# Altium schematic sheet Sheet1.SchDoc
size 839 x 594 mm; SheetNumber: 1; SheetTotal: 3
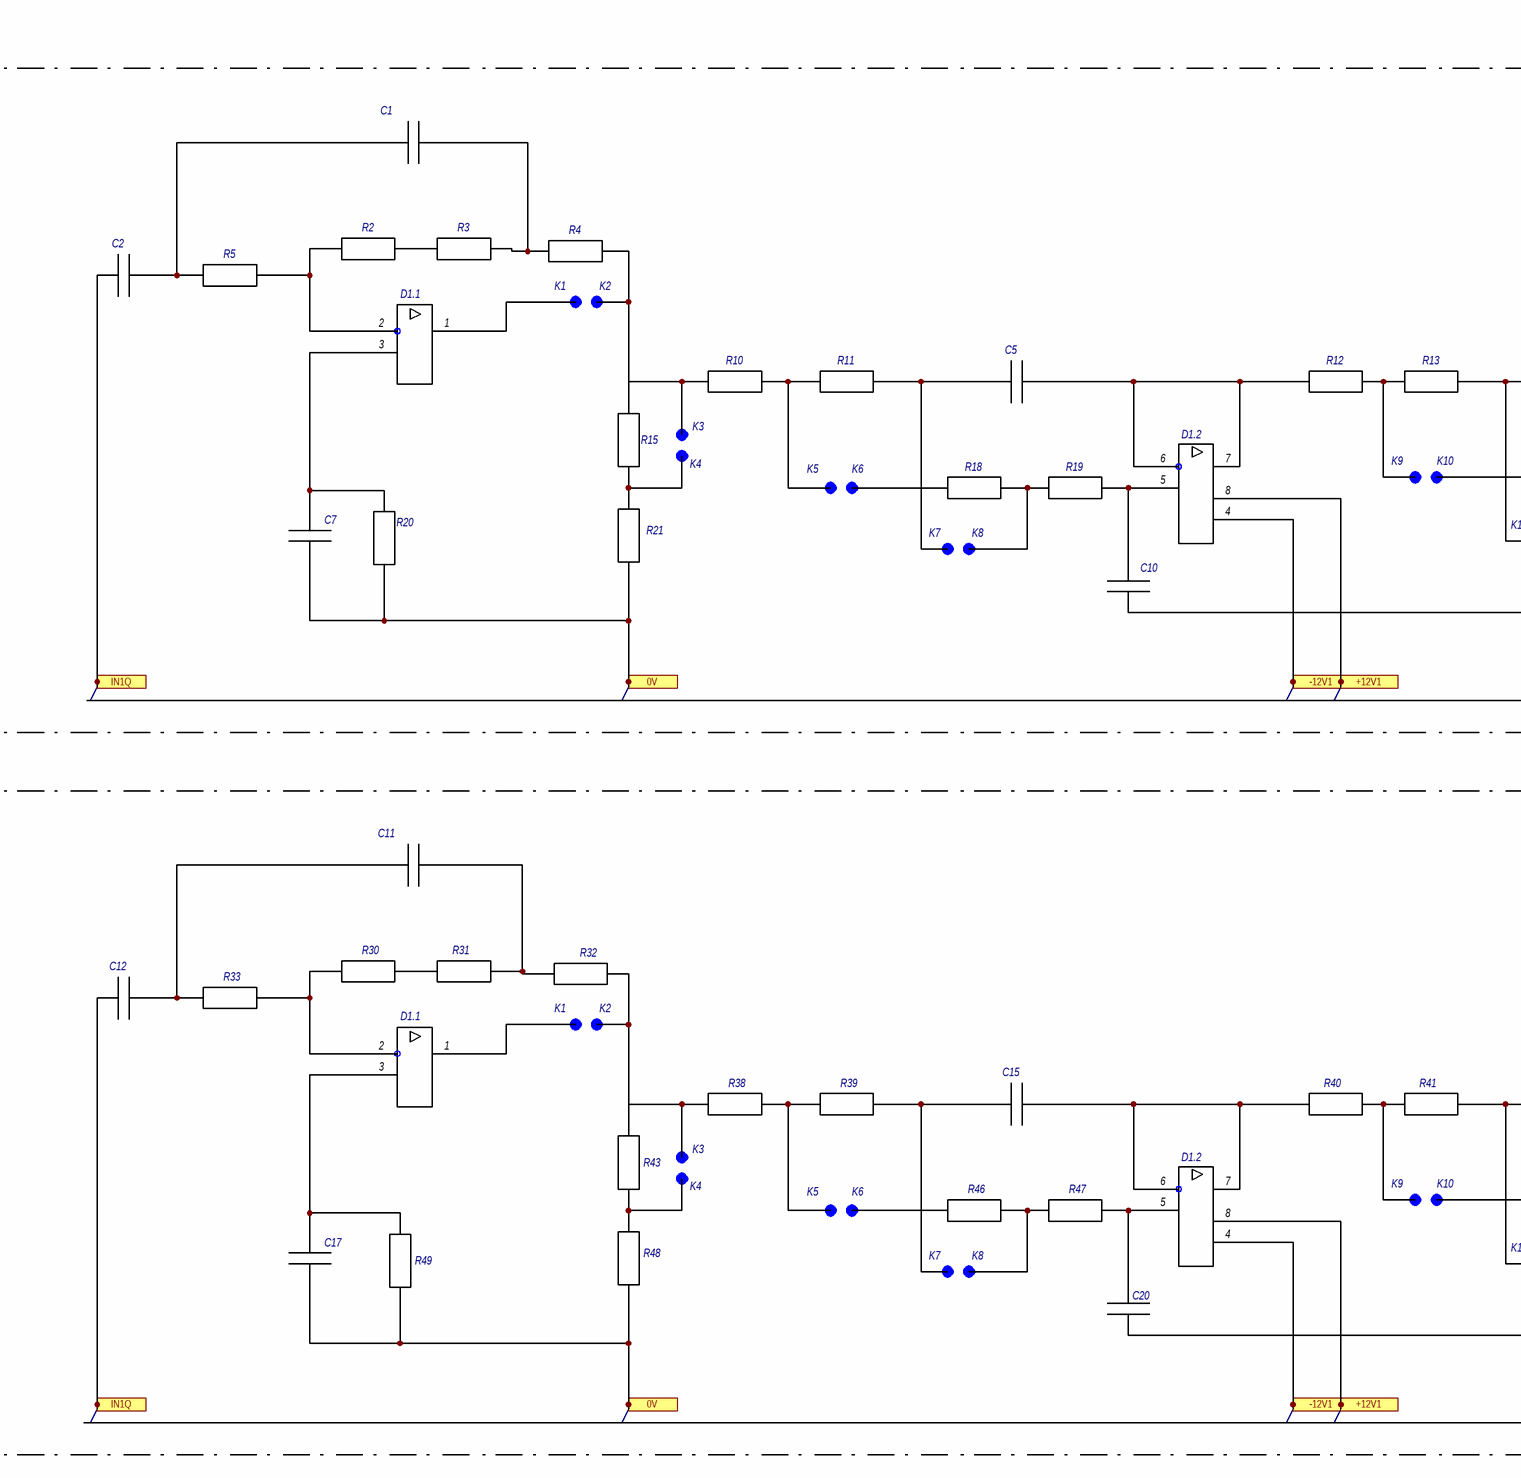
[diagram p0: Sheet1.SchDoc, top left]
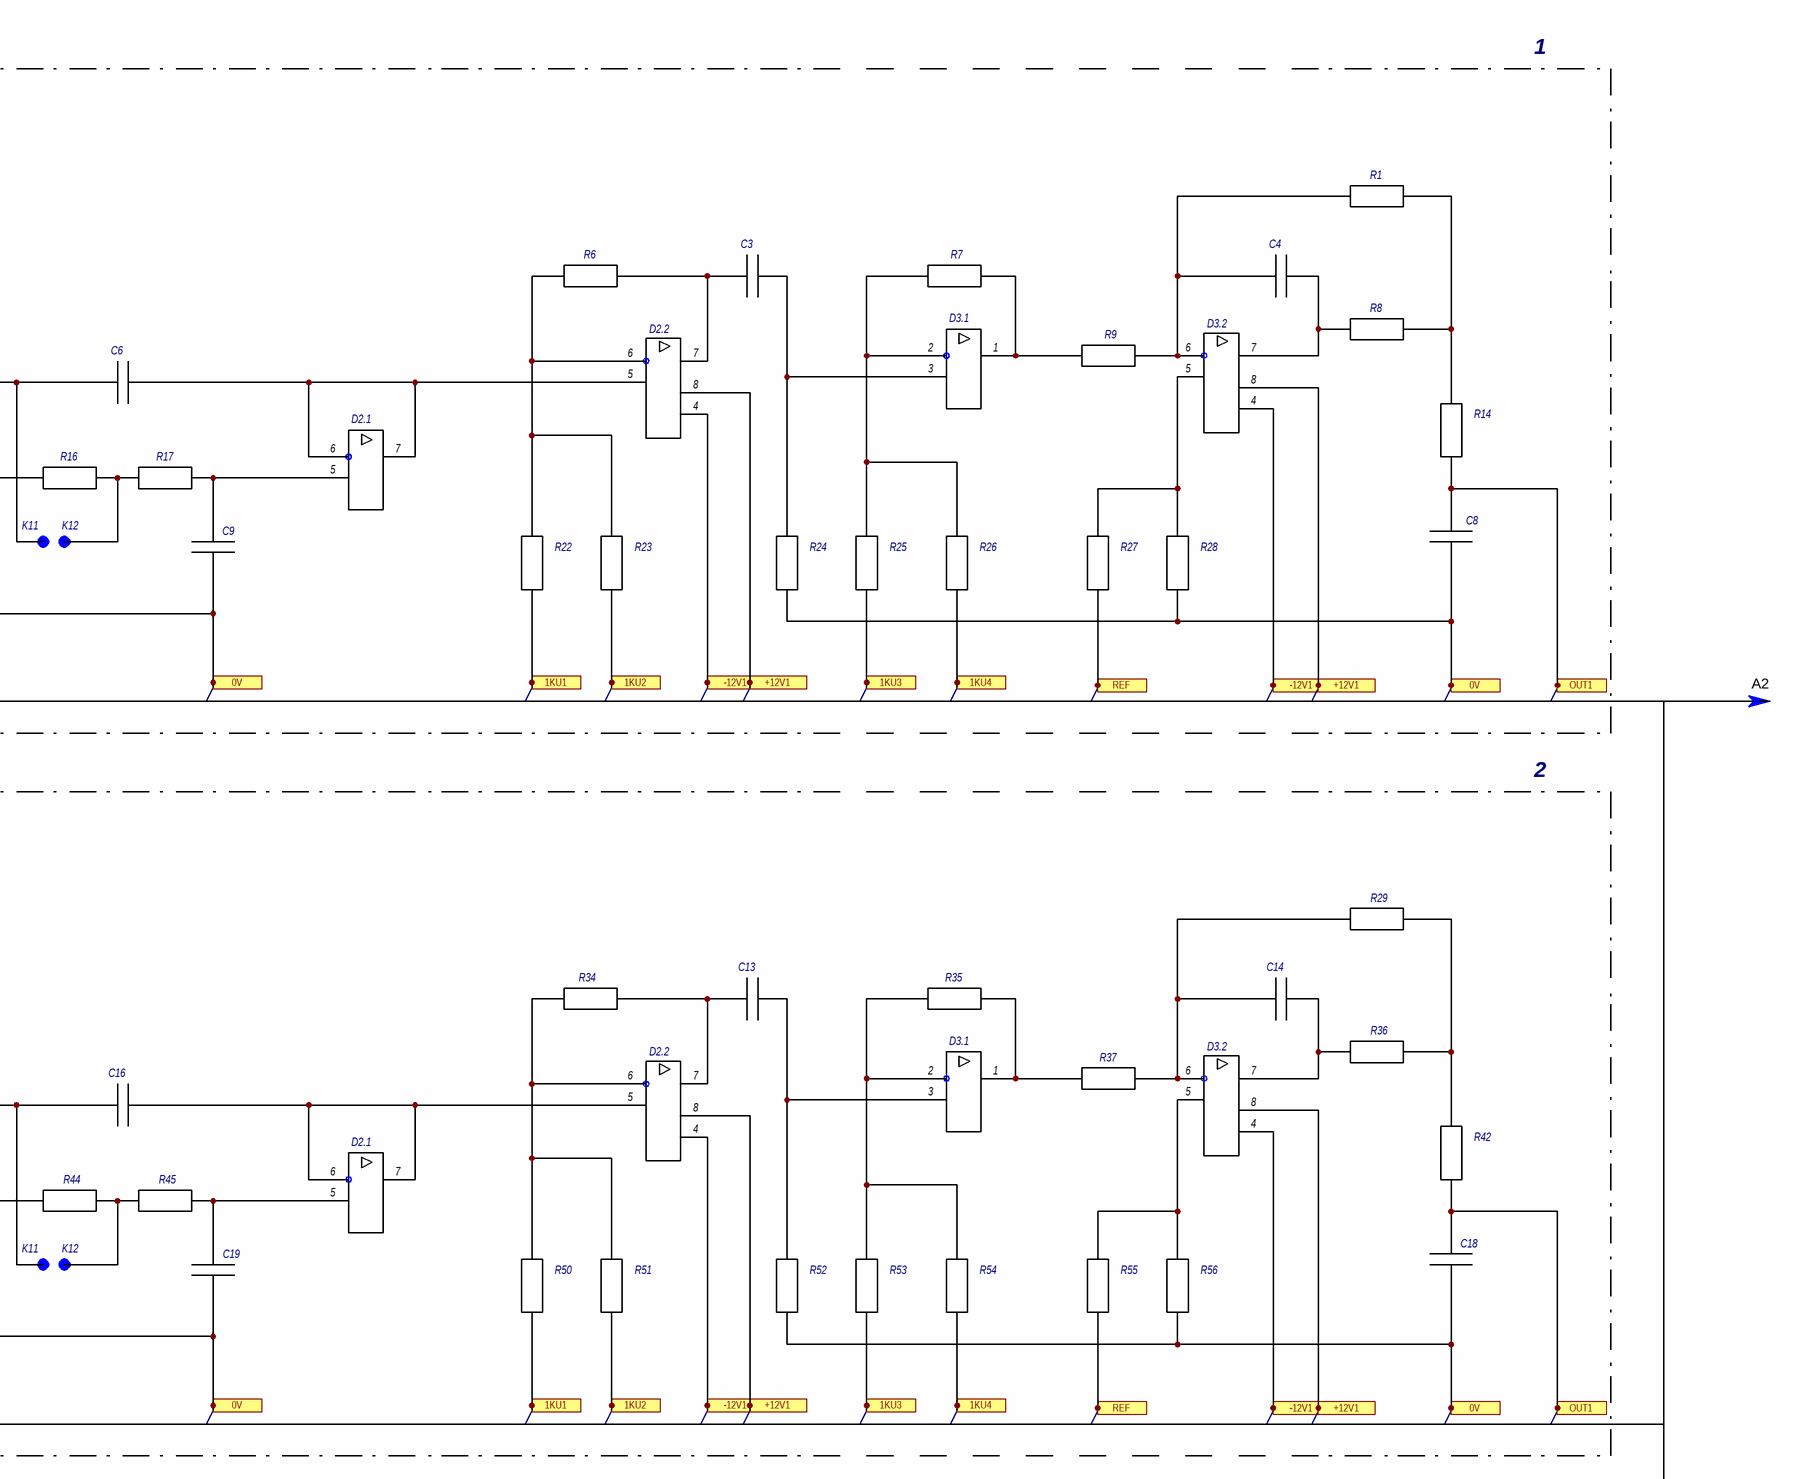
[diagram p1: Sheet1.SchDoc, top right]
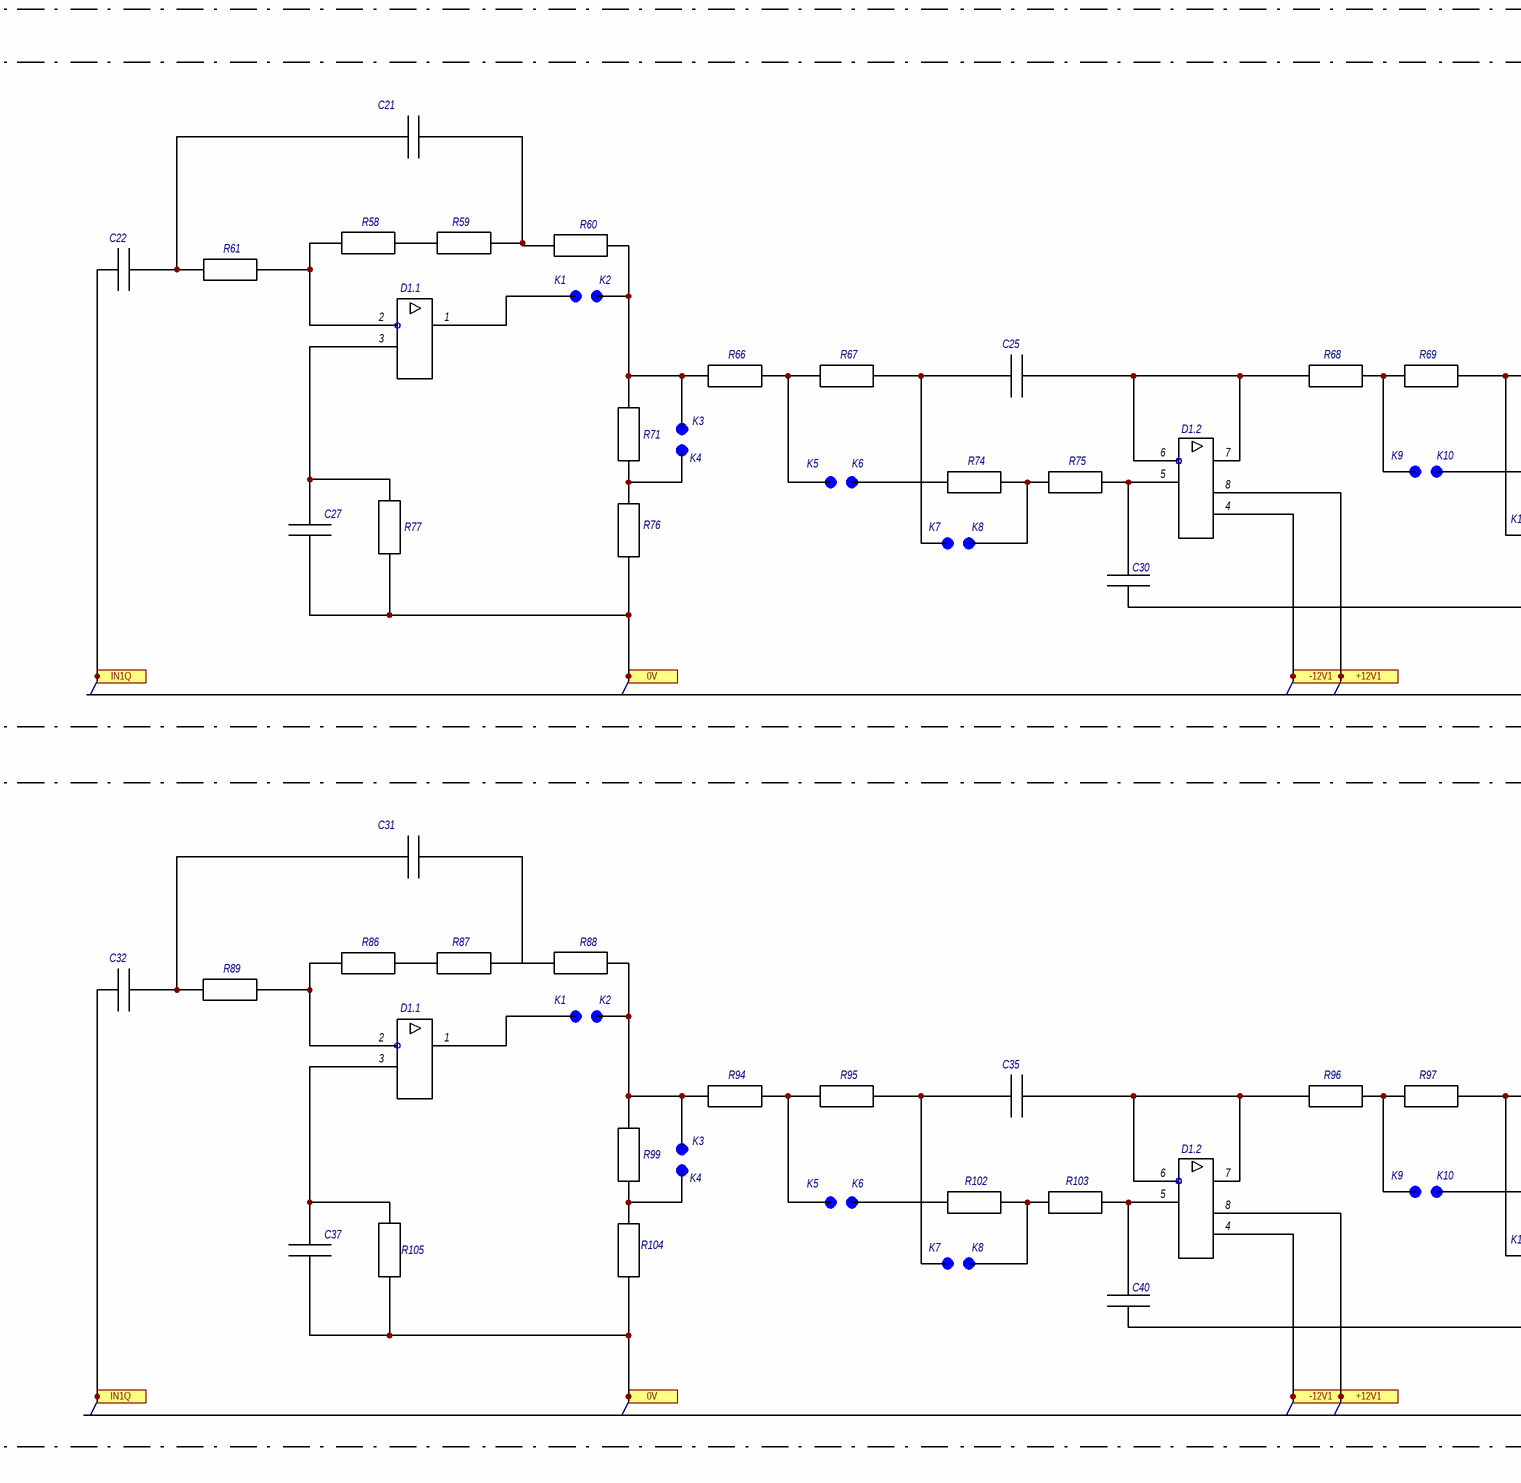
[diagram p2: Sheet1.SchDoc, bottom left]
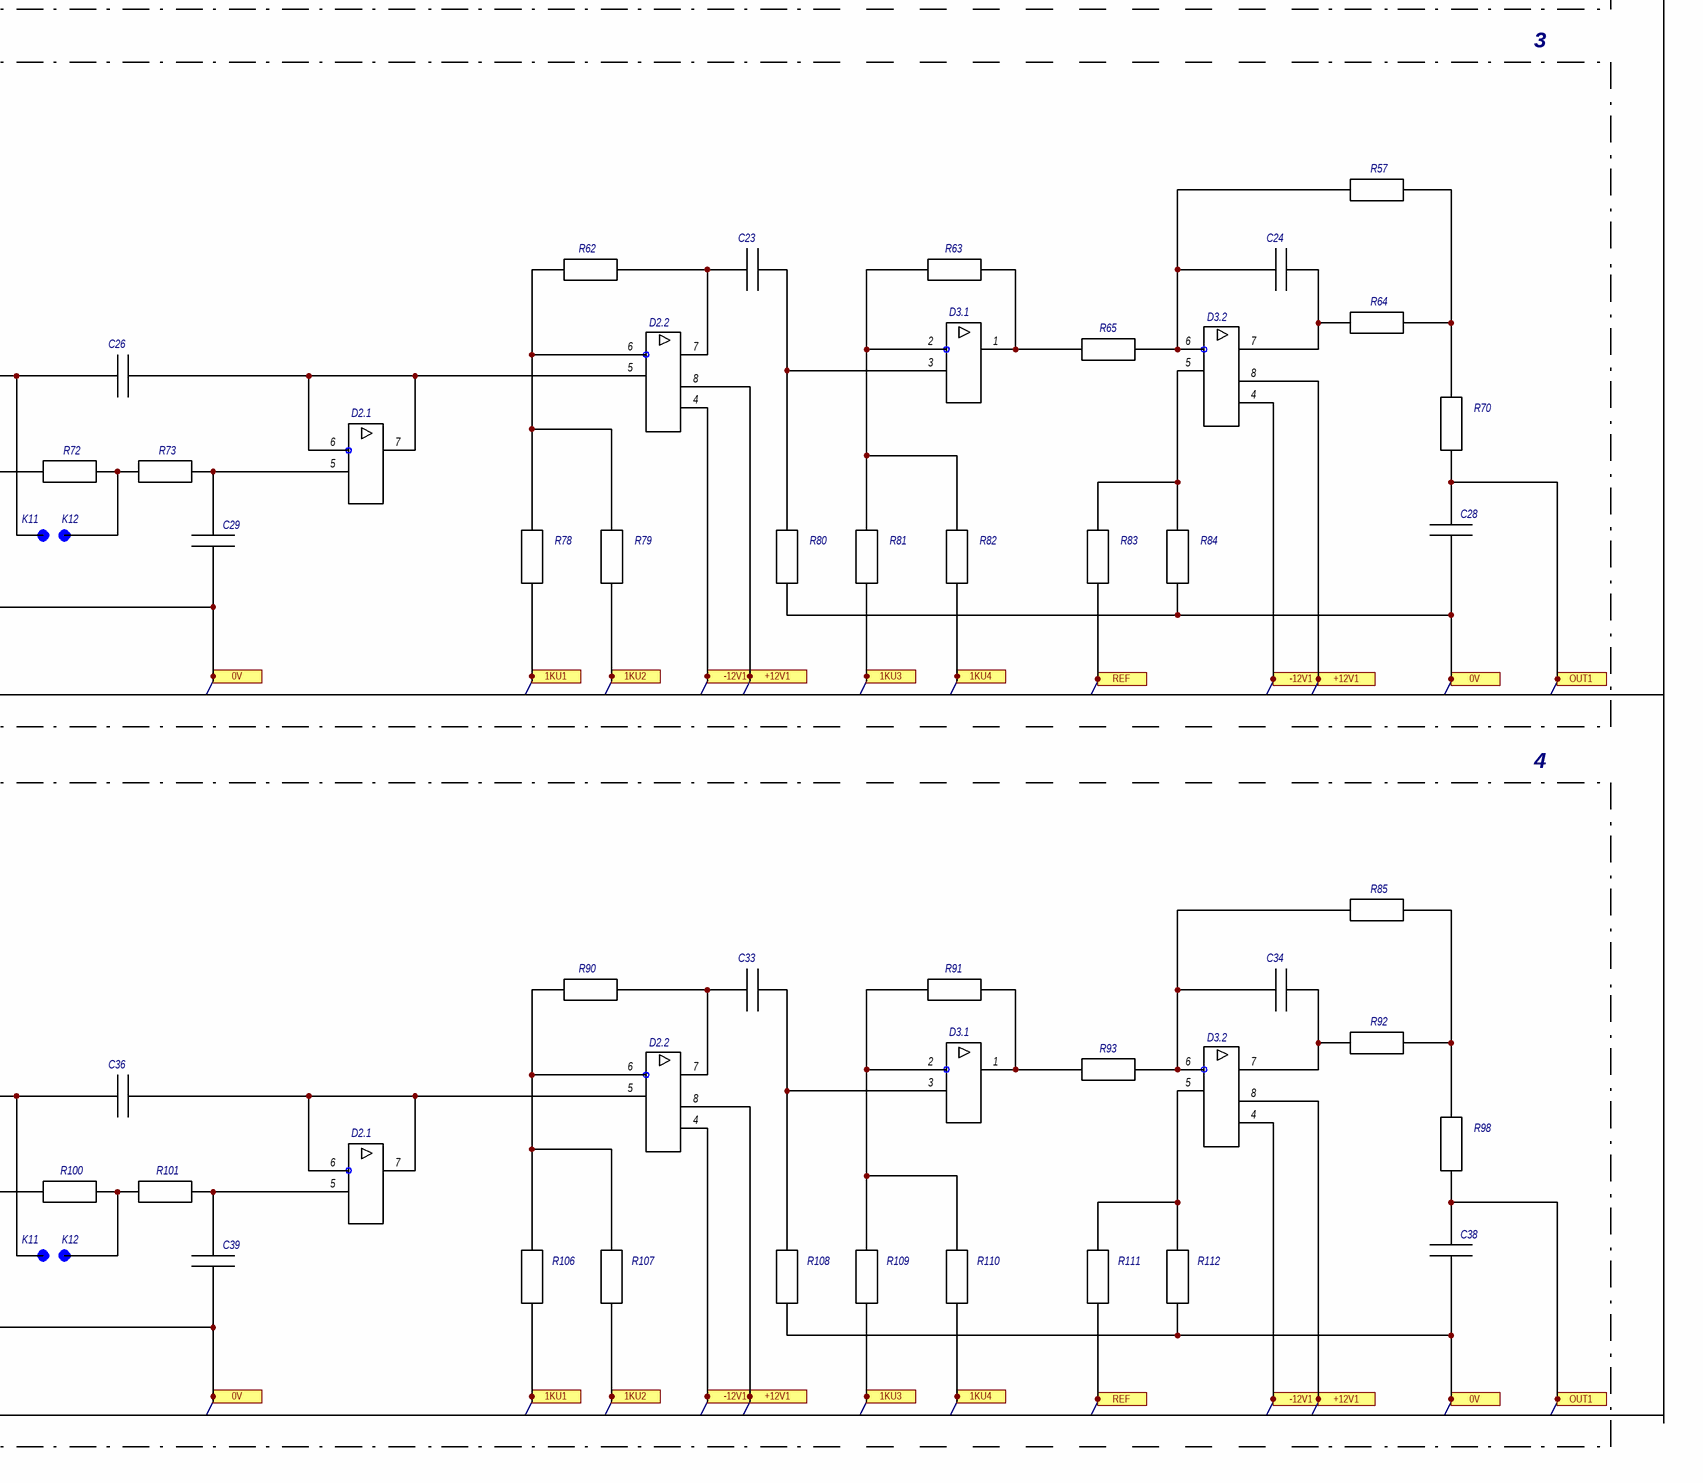
[diagram p3: Sheet1.SchDoc, bottom right]

## Parts
1  DA_AD822V1  [DD_TSOP8V1]  (value not drawn)  (parts A,B of 2)
2  DA_AD822V2  [DD_TSOP8V1]  (value not drawn)
3  DA_AD822V2  [DD_TSOP8V1]  (value not drawn)
4  DA_AD822V2  [DD_TSOP8V1]  (value not drawn)
5  DA_AD822V1  [DD_TSOP8V1]  (value not drawn)  (parts A,B of 2)
6  DA_AD822V2  [DD_TSOP8V1]  (value not drawn)
7  DA_AD822V2  [DD_TSOP8V1]  (value not drawn)
8  DA_AD822V2  [DD_TSOP8V1]  (value not drawn)
9  DA_AD822V1  [DD_TSOP8V1]  (value not drawn)  (parts A,B of 2)
10  DA_AD822V2  [DD_TSOP8V1]  (value not drawn)
11  DA_AD822V2  [DD_TSOP8V1]  (value not drawn)
12  DA_AD822V2  [DD_TSOP8V1]  (value not drawn)
13  DA_AD822V1  [DD_TSOP8V1]  (value not drawn)  (parts A,B of 2)
14  DA_AD822V2  [DD_TSOP8V1]  (value not drawn)
15  DA_AD822V2  [DD_TSOP8V1]  (value not drawn)
16  DA_AD822V2  [DD_TSOP8V1]  (value not drawn)
?  PWR_ARROW  (value not drawn)  (graphical)
C1  C_1210  [C_1210]  (value not drawn)
C2  C_0603  [C_0603]  (value not drawn)
C3  C_0603  [C_0603]  (value not drawn)
C4  C_0603  [C_0603]  (value not drawn)
C5  C_0603  [C_0603]  (value not drawn)
C6  C_0603  [C_0603]  (value not drawn)
C7  C_0603  [C_0603]  (value not drawn)
C8  C_0603  [C_0603]  (value not drawn)
C9  C_0603  [C_0603]  (value not drawn)
C10  C_0603  [C_0603]  (value not drawn)
C11  C_1210  [C_1210]  (value not drawn)
C12  C_0603  [C_0603]  (value not drawn)
C13  C_0603  [C_0603]  (value not drawn)
C14  C_0603  [C_0603]  (value not drawn)
C15  C_0603  [C_0603]  (value not drawn)
C16  C_0603  [C_0603]  (value not drawn)
C17  C_0603  [C_0603]  (value not drawn)
C18  C_0603  [C_0603]  (value not drawn)
C19  C_0603  [C_0603]  (value not drawn)
C20  C_0603  [C_0603]  (value not drawn)
C21  C_1210  [C_1210]  (value not drawn)
C22  C_0603  [C_0603]  (value not drawn)
C23  C_0603  [C_0603]  (value not drawn)
C24  C_0603  [C_0603]  (value not drawn)
C25  C_0603  [C_0603]  (value not drawn)
C26  C_0603  [C_0603]  (value not drawn)
C27  C_0603  [C_0603]  (value not drawn)
C28  C_0603  [C_0603]  (value not drawn)
C29  C_0603  [C_0603]  (value not drawn)
C30  C_0603  [C_0603]  (value not drawn)
C31  C_1210  [C_1210]  (value not drawn)
C32  C_0603  [C_0603]  (value not drawn)
C33  C_0603  [C_0603]  (value not drawn)
C34  C_0603  [C_0603]  (value not drawn)
C35  C_0603  [C_0603]  (value not drawn)
C36  C_0603  [C_0603]  (value not drawn)
C37  C_0603  [C_0603]  (value not drawn)
C38  C_0603  [C_0603]  (value not drawn)
C39  C_0603  [C_0603]  (value not drawn)
C40  C_0603  [C_0603]  (value not drawn)
D1  DA_AD822V1  [DD_TSOP8V1]  (value not drawn)  (part A of 2)
D2  DA_AD822V1  [DD_TSOP8V1]  (value not drawn)  (part A of 2)
D3  DA_AD822V1  [DD_TSOP8V1]  (value not drawn)  (part A of 2)
D4  DA_AD822V1  [DD_TSOP8V1]  (value not drawn)  (part A of 2)
JP1  X_JP-PCB1.4  [X_JP-PCB1.4]  (value not drawn)
JP2  X_JP-PCB1.4  [X_JP-PCB1.4]  (value not drawn)
JP3  X_JP-PCB1.4  [X_JP-PCB1.4]  (value not drawn)
JP4  X_JP-PCB1.4  [X_JP-PCB1.4]  (value not drawn)
JP5  X_JP-PCB1.4  [X_JP-PCB1.4]  (value not drawn)
JP6  X_JP-PCB1.4  [X_JP-PCB1.4]  (value not drawn)
JP7  X_JP-PCB1.4  [X_JP-PCB1.4]  (value not drawn)
JP8  X_JP-PCB1.4  [X_JP-PCB1.4]  (value not drawn)
JP9  X_JP-PCB1.4  [X_JP-PCB1.4]  (value not drawn)
JP10  X_JP-PCB1.4  [X_JP-PCB1.4]  (value not drawn)
JP11  X_JP-PCB1.4  [X_JP-PCB1.4]  (value not drawn)
JP12  X_JP-PCB1.4  [X_JP-PCB1.4]  (value not drawn)
JP13  X_JP-PCB1.4  [X_JP-PCB1.4]  (value not drawn)
JP14  X_JP-PCB1.4  [X_JP-PCB1.4]  (value not drawn)
JP15  X_JP-PCB1.4  [X_JP-PCB1.4]  (value not drawn)
JP16  X_JP-PCB1.4  [X_JP-PCB1.4]  (value not drawn)
JP17  X_JP-PCB1.4  [X_JP-PCB1.4]  (value not drawn)
JP18  X_JP-PCB1.4  [X_JP-PCB1.4]  (value not drawn)
JP19  X_JP-PCB1.4  [X_JP-PCB1.4]  (value not drawn)
JP20  X_JP-PCB1.4  [X_JP-PCB1.4]  (value not drawn)
JP21  X_JP-PCB1.4  [X_JP-PCB1.4]  (value not drawn)
JP22  X_JP-PCB1.4  [X_JP-PCB1.4]  (value not drawn)
JP23  X_JP-PCB1.4  [X_JP-PCB1.4]  (value not drawn)
JP24  X_JP-PCB1.4  [X_JP-PCB1.4]  (value not drawn)
R1  R_0603  [R_0603]  (value not drawn)
R2  R_0603  [R_0603]  (value not drawn)
R3  R_0603  [R_0603]  (value not drawn)
R4  R_0603  [R_0603]  (value not drawn)
R5  R_0603  [R_0603]  (value not drawn)
R6  R_0603  [R_0603]  (value not drawn)
R7  R_0603  [R_0603]  (value not drawn)
R8  R_0603  [R_0603]  (value not drawn)
R9  R_0603  [R_0603]  (value not drawn)
R10  R_0603  [R_0603]  (value not drawn)
R11  R_0603  [R_0603]  (value not drawn)
R12  R_0603  [R_0603]  (value not drawn)
R13  R_0603  [R_0603]  (value not drawn)
R14  R_0603  [R_0603]  (value not drawn)
R15  R_0603  [R_0603]  (value not drawn)
R16  R_0603  [R_0603]  (value not drawn)
R17  R_0603  [R_0603]  (value not drawn)
R18  R_0603  [R_0603]  (value not drawn)
R19  R_0603  [R_0603]  (value not drawn)
R20  R_0603  [R_0603]  (value not drawn)
R21  R_0603  [R_0603]  (value not drawn)
R22  R_0603  [R_0603]  (value not drawn)
R23  R_0603  [R_0603]  (value not drawn)
R24  R_0603  [R_0603]  (value not drawn)
R25  R_0603  [R_0603]  (value not drawn)
R26  R_0603  [R_0603]  (value not drawn)
R27  R_0603  [R_0603]  (value not drawn)
R28  R_0603  [R_0603]  (value not drawn)
R29  R_0603  [R_0603]  (value not drawn)
R30  R_0603  [R_0603]  (value not drawn)
R31  R_0603  [R_0603]  (value not drawn)
R32  R_0603  [R_0603]  (value not drawn)
R33  R_0603  [R_0603]  (value not drawn)
R34  R_0603  [R_0603]  (value not drawn)
R35  R_0603  [R_0603]  (value not drawn)
R36  R_0603  [R_0603]  (value not drawn)
R37  R_0603  [R_0603]  (value not drawn)
R38  R_0603  [R_0603]  (value not drawn)
R39  R_0603  [R_0603]  (value not drawn)
R40  R_0603  [R_0603]  (value not drawn)
R41  R_0603  [R_0603]  (value not drawn)
R42  R_0603  [R_0603]  (value not drawn)
R43  R_0603  [R_0603]  (value not drawn)
R44  R_0603  [R_0603]  (value not drawn)
R45  R_0603  [R_0603]  (value not drawn)
R46  R_0603  [R_0603]  (value not drawn)
R47  R_0603  [R_0603]  (value not drawn)
R48  R_0603  [R_0603]  (value not drawn)
R49  R_0603  [R_0603]  (value not drawn)
R50  R_0603  [R_0603]  (value not drawn)
R51  R_0603  [R_0603]  (value not drawn)
R52  R_0603  [R_0603]  (value not drawn)
R53  R_0603  [R_0603]  (value not drawn)
R54  R_0603  [R_0603]  (value not drawn)
R55  R_0603  [R_0603]  (value not drawn)
R56  R_0603  [R_0603]  (value not drawn)
R57  R_0603  [R_0603]  (value not drawn)
R58  R_0603  [R_0603]  (value not drawn)
R59  R_0603  [R_0603]  (value not drawn)
R60  R_0603  [R_0603]  (value not drawn)
R61  R_0603  [R_0603]  (value not drawn)
R62  R_0603  [R_0603]  (value not drawn)
R63  R_0603  [R_0603]  (value not drawn)
R64  R_0603  [R_0603]  (value not drawn)
R65  R_0603  [R_0603]  (value not drawn)
R66  R_0603  [R_0603]  (value not drawn)
R67  R_0603  [R_0603]  (value not drawn)
R68  R_0603  [R_0603]  (value not drawn)
R69  R_0603  [R_0603]  (value not drawn)
R70  R_0603  [R_0603]  (value not drawn)
R71  R_0603  [R_0603]  (value not drawn)
R72  R_0603  [R_0603]  (value not drawn)
R73  R_0603  [R_0603]  (value not drawn)
R74  R_0603  [R_0603]  (value not drawn)
R75  R_0603  [R_0603]  (value not drawn)
R76  R_0603  [R_0603]  (value not drawn)
R77  R_0603  [R_0603]  (value not drawn)
R78  R_0603  [R_0603]  (value not drawn)
R79  R_0603  [R_0603]  (value not drawn)
R80  R_0603  [R_0603]  (value not drawn)
R81  R_0603  [R_0603]  (value not drawn)
R82  R_0603  [R_0603]  (value not drawn)
R83  R_0603  [R_0603]  (value not drawn)
R84  R_0603  [R_0603]  (value not drawn)
R85  R_0603  [R_0603]  (value not drawn)
R86  R_0603  [R_0603]  (value not drawn)
R87  R_0603  [R_0603]  (value not drawn)
R88  R_0603  [R_0603]  (value not drawn)
R89  R_0603  [R_0603]  (value not drawn)
R90  R_0603  [R_0603]  (value not drawn)
R91  R_0603  [R_0603]  (value not drawn)
R92  R_0603  [R_0603]  (value not drawn)
R93  R_0603  [R_0603]  (value not drawn)
R94  R_0603  [R_0603]  (value not drawn)
R95  R_0603  [R_0603]  (value not drawn)
R96  R_0603  [R_0603]  (value not drawn)
R97  R_0603  [R_0603]  (value not drawn)
R98  R_0603  [R_0603]  (value not drawn)
R99  R_0603  [R_0603]  (value not drawn)
R100  R_0603  [R_0603]  (value not drawn)
R101  R_0603  [R_0603]  (value not drawn)
R102  R_0603  [R_0603]  (value not drawn)
R103  R_0603  [R_0603]  (value not drawn)
R104  R_0603  [R_0603]  (value not drawn)
R105  R_0603  [R_0603]  (value not drawn)
R106  R_0603  [R_0603]  (value not drawn)
R107  R_0603  [R_0603]  (value not drawn)
R108  R_0603  [R_0603]  (value not drawn)
R109  R_0603  [R_0603]  (value not drawn)
R110  R_0603  [R_0603]  (value not drawn)
R111  R_0603  [R_0603]  (value not drawn)
R112  R_0603  [R_0603]  (value not drawn)

## Ports
0V, 1KU1, 1KU2, 1KU3, 1KU4, +12V1, -12V1, IN1Q, OUT1, REF

## Nets
+VA: 1.4(+VA) 1.8(+VA) 5.4(+VA) 5.8(+VA) 9.4(+VA) 9.8(+VA) 13.4(+VA) 13.8(+VA) D1.4(+VA) D1.8(+VA) D2.4(+VA) D2.8(+VA) D3.4(+VA) D3.8(+VA) D4.4(+VA) D4.8(+VA)
0V: C7.2 C8.1 C9.2 C10.2 C17.2 C18.1 C19.2 C20.2 C27.2 C28.1 C29.2 C30.2 C37.2 C38.1 C39.2 C40.2 R20.1 R21.1 R24.2 R28.2 R48.1 R49.1 R52.2 R56.2 R76.1 R77.1 R80.2 R84.2 R104.1 R105.1 R108.2 R112.2 ; port 0V
1KU1: R22.2 R50.2 R78.2 R106.2 ; port 1KU1
1KU2: R23.2 R51.2 R79.2 R107.2 ; port 1KU2
1KU3: R25.2 R53.2 R81.2 R109.2 ; port 1KU3
1KU4: R26.2 R54.2 R82.2 R110.2 ; port 1KU4
+12V1: 2.8 3.8 4.8 6.8 7.8 8.8 10.8 11.8 12.8 14.8 15.8 16.8 ; port +12V1
-12V1: 2.4 3.4 4.4 6.4 7.4 8.4 10.4 11.4 12.4 14.4 15.4 16.4 ; port -12V1
IN1Q: C2.1 C12.1 C22.1 C32.1 ; port IN1Q
OUT1: C8.2 C18.2 C28.2 C38.2 R14.2 R42.2 R70.2 R98.2 ; port OUT1
REF: R27.2 R55.2 R83.2 R111.2 ; port REF
Net1_1: 1.1 R7.1 R9.2
Net1_2: 1.2 R7.2 R25.1 R26.1
Net1_3: 1.3 C3.2 R24.1
Net1_5: 1.5 C9.1 R17.1
Net1_6: 1.6 1.7 3.5 C6.2
Net2_5: 2.5 R27.1 R28.1
Net2_6: 2.6 C4.1 R1.2 R9.1
Net2_7: 2.7 C4.2 R8.2
Net3_6: 3.6 R6.2 R22.1 R23.1
Net3_7: 3.7 C3.1 R6.1
Net4_5: 4.5 C10.1 R19.1
Net4_6: 4.6 4.7 C5.2 R12.2
Net5_1: 5.1 R35.1 R37.2
Net5_2: 5.2 R35.2 R53.1 R54.1
Net5_3: 5.3 C13.2 R52.1
Net5_5: 5.5 C19.1 R45.1
Net5_6: 5.6 5.7 7.5 C16.2
Net6_5: 6.5 R55.1 R56.1
Net6_6: 6.6 C14.1 R29.2 R37.1
Net6_7: 6.7 C14.2 R36.2
Net7_6: 7.6 R34.2 R50.1 R51.1
Net7_7: 7.7 C13.1 R34.1
Net8_5: 8.5 C20.1 R47.1
Net8_6: 8.6 8.7 C15.2 R40.2
Net9_1: 9.1 R63.1 R65.2
Net9_2: 9.2 R63.2 R81.1 R82.1
Net9_3: 9.3 C23.2 R80.1
Net9_5: 9.5 C29.1 R73.1
Net9_6: 9.6 9.7 11.5 C26.2
Net10_5: 10.5 R83.1 R84.1
Net10_6: 10.6 C24.1 R57.2 R65.1
Net10_7: 10.7 C24.2 R64.2
Net11_6: 11.6 R62.2 R78.1 R79.1
Net11_7: 11.7 C23.1 R62.1
Net12_5: 12.5 C30.1 R75.1
Net12_6: 12.6 12.7 C25.2 R68.2
Net13_1: 13.1 R91.1 R93.2
Net13_2: 13.2 R91.2 R109.1 R110.1
Net13_3: 13.3 C33.2 R108.1
Net13_5: 13.5 C39.1 R101.1
Net13_6: 13.6 13.7 15.5 C36.2
Net14_5: 14.5 R111.1 R112.1
Net14_6: 14.6 C34.1 R85.2 R93.1
Net14_7: 14.7 C34.2 R92.2
Net15_6: 15.6 R90.2 R106.1 R107.1
Net15_7: 15.7 C33.1 R90.1
Net16_5: 16.5 C40.1 R103.1
Net16_6: 16.6 16.7 C35.2 R96.2
NetC1_1: C1.1 R3.1 R4.2
NetC1_2: C1.2 C2.2 R5.2
NetC5_1: C5.1 JP6.1 R11.1
NetC6_1: C6.1 JP5.1 R13.1
NetC7_1: C7.1 D1.3 R20.2
NetC11_1: C11.1 R31.1 R32.2
NetC11_2: C11.2 C12.2 R33.2
NetC15_1: C15.1 JP12.1 R39.1
NetC16_1: C16.1 JP11.1 R41.1
NetC17_1: C17.1 D2.3 R49.2
NetC21_1: C21.1 R59.1 R60.2
NetC21_2: C21.2 C22.2 R61.2
NetC25_1: C25.1 JP18.1 R67.1
NetC26_1: C26.1 JP17.1 R69.1
NetC27_1: C27.1 D3.3 R77.2
NetC31_1: C31.1 R87.1 R88.2
NetC31_2: C31.2 C32.2 R89.2
NetC35_1: C35.1 JP24.1 R95.1
NetC36_1: C36.1 JP23.1 R97.1
NetC37_1: C37.1 D4.3 R105.2
NetD1_1: D1.1 JP1.1
NetD1_2: D1.2 R2.2 R5.1
NetD2_1: D2.1 JP7.1
NetD2_2: D2.2 R30.2 R33.1
NetD3_1: D3.1 JP13.1
NetD3_2: D3.2 R58.2 R61.1
NetD4_1: D4.1 JP19.1
NetD4_2: D4.2 R86.2 R89.1
NetJP1_2: JP1.2 JP2.1 R4.1 R10.2 R15.2
NetJP2_2: JP2.2 R15.1 R21.2
NetJP3_1: JP3.1 R12.1 R13.2
NetJP3_2: JP3.2 R16.2
NetJP4_1: JP4.1 R10.1 R11.2
NetJP4_2: JP4.2 R18.2
NetJP5_2: JP5.2 R16.1 R17.2
NetJP6_2: JP6.2 R18.1 R19.2
NetJP7_2: JP7.2 JP8.1 R32.1 R38.2 R43.2
NetJP8_2: JP8.2 R43.1 R48.2
NetJP9_1: JP9.1 R40.1 R41.2
NetJP9_2: JP9.2 R44.2
NetJP10_1: JP10.1 R38.1 R39.2
NetJP10_2: JP10.2 R46.2
NetJP11_2: JP11.2 R44.1 R45.2
NetJP12_2: JP12.2 R46.1 R47.2
NetJP13_2: JP13.2 JP14.1 R60.1 R66.2 R71.2
NetJP14_2: JP14.2 R71.1 R76.2
NetJP15_1: JP15.1 R68.1 R69.2
NetJP15_2: JP15.2 R72.2
NetJP16_1: JP16.1 R66.1 R67.2
NetJP16_2: JP16.2 R74.2
NetJP17_2: JP17.2 R72.1 R73.2
NetJP18_2: JP18.2 R74.1 R75.2
NetJP19_2: JP19.2 JP20.1 R88.1 R94.2 R99.2
NetJP20_2: JP20.2 R99.1 R104.2
NetJP21_1: JP21.1 R96.1 R97.2
NetJP21_2: JP21.2 R100.2
NetJP22_1: JP22.1 R94.1 R95.2
NetJP22_2: JP22.2 R102.2
NetJP23_2: JP23.2 R100.1 R101.2
NetJP24_2: JP24.2 R102.1 R103.2
NetR1_1: R1.1 R8.1 R14.1
NetR2_1: R2.1 R3.2
NetR29_1: R29.1 R36.1 R42.1
NetR30_1: R30.1 R31.2
NetR57_1: R57.1 R64.1 R70.1
NetR58_1: R58.1 R59.2
NetR85_1: R85.1 R92.1 R98.1
NetR86_1: R86.1 R87.2

Not connected (* = marked no-connect by the designer): ? 1

## Notes on the sheet
- 1
- D1.1
- (near JP1) K1
- (near JP1) K2
- (near 3) D2.2
- D3.1
- (near 2) D3.2
- (near JP2) K3
- (near 1) D2.1
- (near JP2) K4
- (near JP4) K5
- (near JP4) K6
- (near 4) D1.2
- (near JP3) K9
- (near JP3) K10
- (near JP6) K7
- (near JP6) K8
- (near JP5) K11
- (near JP5) K12
- (near ?) A2
- 2
- (near JP7) K1
- (near JP7) K2
- (near 7) D2.2
- (near 6) D3.2
- (near JP8) K3
- (near 8) D1.2
- (near 5) D2.1
- (near JP8) K4
- (near JP10) K5
- (near JP10) K6
- (near JP9) K9
- (near JP9) K10
- (near JP12) K7
- (near JP12) K8
- (near JP11) K11
- (near JP11) K12
- 3
- (near JP13) K1
- (near JP13) K2
- (near 11) D2.2
- (near 10) D3.2
- (near JP14) K4
- (near JP14) K3
- (near JP16) K5
- (near JP16) K6
- (near 12) D1.2
- (near JP15) K9
- (near JP15) K10
- (near 9) D2.1
- (near JP18) K7
- (near JP18) K8
- (near JP17) K11
- (near JP17) K12
- 4
- (near JP19) K1
- (near JP19) K2
- (near 15) D2.2
- (near 14) D3.2
- (near JP20) K3
- (near 13) D2.1
- (near JP20) K4
- (near JP22) K5
- (near JP22) K6
- (near 16) D1.2
- (near JP21) K9
- (near JP21) K10
- (near JP24) K7
- (near JP24) K8
- (near JP23) K11
- (near JP23) K12
- Перв.примен.
- Справ.№
- Подп. и дата
- Инв.№ дубл.
- Взам.инв.№
- Подп.и дата
- Разраб.
- Изм.
- Лист
- № докум.
- Подп.
- Дата
- Лит.
- Масштаб
- Масса
- Т.контр.
- Пров.
- Листов
- Инв.№ подл.
- Утв.
- Н.контр.
- Нач.сект.
- Копировал
- Формат  A1

## Library data of the parts
1 5 9 13 D1-D4 = DA_AD822V1: Value: AD822
2-4 6-8 10-12 14-16 = DA_AD822V2: Value: AD822
C1 C11 C21 C31 = C_1210: Value: 4020 1%
C2 C12 C22 C32 = C_0603: 0805; Value: 0,47; Mark: 0,01
C3 C13 C23 C33 = C_0603: 0805; Value: 0,15; Mark: 0,01
C4 C14 C24 C34 = C_0603: 0805; Value: 51pF; Mark: 0,01
C5 C6 C15 C16 C25 C26 C35 C36 = C_0603: 0805; Value: 0,0047; Mark: 0,01
C7 C17 C27 C37 = C_0603: 0805; Value: 0,033; Mark: 0,01
C8 C18 C28 C38 = C_0603: 0805; Value: 0,003; Mark: 0,01
C9 C19 C29 C39 = C_0603: 0805; Value: 0,0024; Mark: 0,01
C10 C20 C30 C40 = C_0603: 0805; Value: 0,00013; Mark: 0,01
R1 R7 R9 R22 R27-R29 R35 R37 R50 R55-R57 R63 R65 R78 R83-R85 R91 R93 R106 R111 R112 = R_0603: Value: 30,1к
R2 R5 R20 R30 R33 R49 R58 R61 R77 R86 R89 R105 = R_0603: Value: 200к
R3 R21 R31 R48 R59 R76 R87 R104 = R_0603: Value: 4,02к
R4 R32 R60 R88 = R_0603: Value: 40,2к
R6 R34 R62 R90 = R_0603: Value: 30.1к
R8 R36 R64 R92 = R_0603: Value: 100
R10 R19 R38 R47 R66 R75 R94 R103 = R_0603: Value: 84,5к
R11 R18 R39 R46 R67 R74 R95 R102 = R_0603: Value: 6,19к
R12 R17 R40 R45 R68 R73 R96 R101 = R_0603: Value: 34,8к
R13 R16 R41 R44 R69 R72 R97 R100 = R_0603: Value: 3,32к
R14 R42 R70 R98 = R_0603: Value: 511
R15 R43 R71 R99 = R_0603: Value: 1к
R23 R51 R79 R107 = R_0603: Value: 10к
R24 R52 R80 R108 = R_0603: Value: 154к
R25 R53 R81 R109 = R_0603: Value: 4,27к
R26 R54 R82 R110 = R_0603: Value: 976
JP1-JP24 = X_JP-PCB1.4: Value: *